# Altium project HDMI_Adapter_RevA.PrjPCB
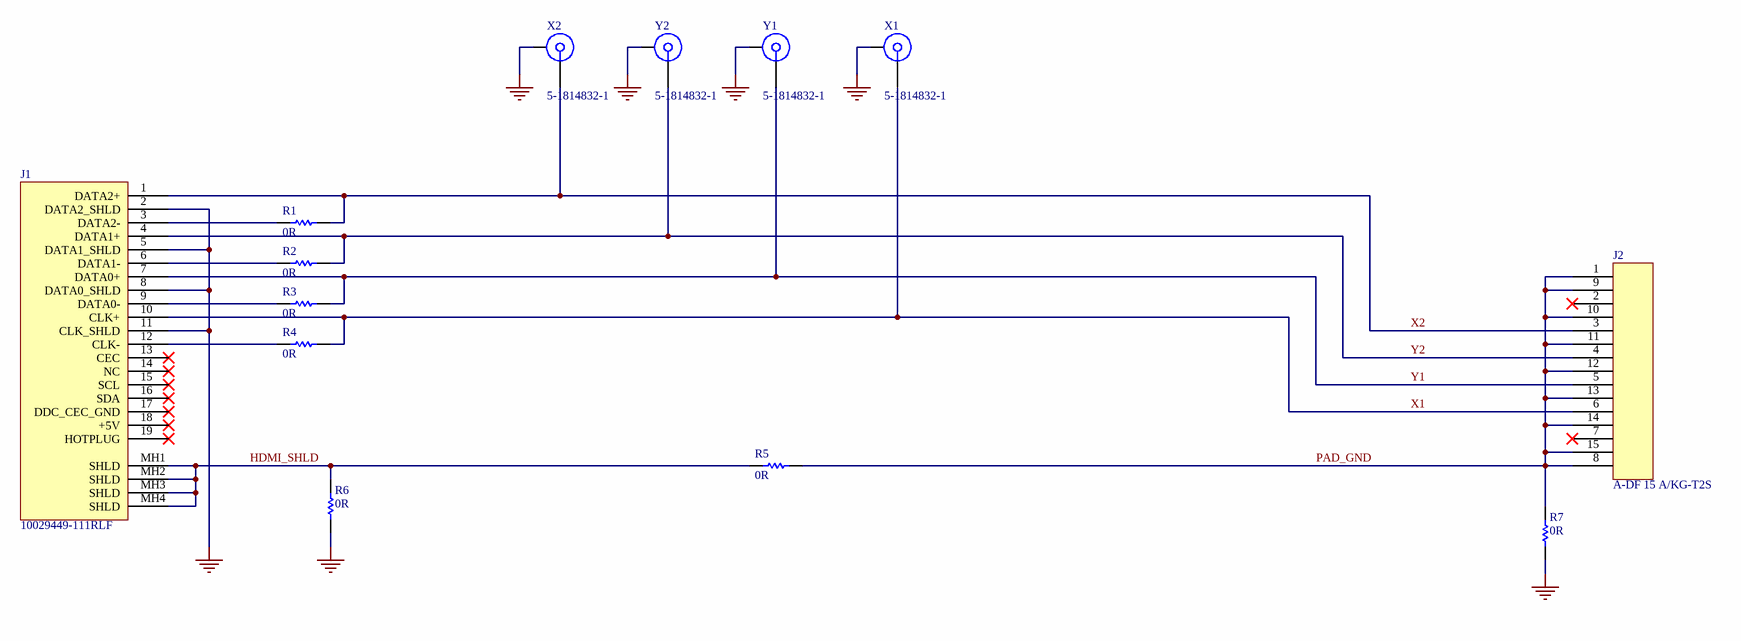
[diagram p0: HDMI_Adapter_RevA.SchDoc]
ProjectRevision: A
1 sheet, 13 parts. Net scope: global (net labels, ports and power ports of the same name join across sheets).
Board file: HDMI_Adapter_RevA.PcbDoc

## Sheet HDMI_Adapter_RevA.SchDoc
size Tabloid

### Parts
J1  10029449-111RLF  [10029449-111RLF]
J2  A-DF 15 A/KG-T2S  [A-DF 15 A/KG-T2S]
R1  value 0R  [RES-0603-M]  (hidden comment: RES 0R Jumper 1/10 W 0603)
R2  value 0R  [RES-0603-M]  (hidden comment: RES 0R Jumper 1/10 W 0603)
R3  value 0R  [RES-0603-M]  (hidden comment: RES 0R Jumper 1/10 W 0603)
R4  value 0R  [RES-0603-M]  (hidden comment: RES 0R Jumper 1/10 W 0603)
R5  value 0R  [RES-0603-M]  (hidden comment: RES 0R Jumper 1/10 W 0603)
R6  value 0R  [RES-0603-M]  (hidden comment: RES 0R Jumper 1/10 W 0603)
R7  value 0R  [RES-0603-M]  (hidden comment: RES 0R Jumper 1/10 W 0603)
X1  5-1814832-1  [5-1814832-1]
X2  5-1814832-1  [5-1814832-1]
Y1  5-1814832-1  [5-1814832-1]
Y2  5-1814832-1  [5-1814832-1]

### Nets
GND: J1.2(DATA2_SHLD) J1.5(DATA1_SHLD) J1.8(DATA0_SHLD) J1.11(CLK_SHLD) R6.2 R7.2 X1.MH X2.MH Y1.MH Y2.MH
HDMI_SHLD: J1.MH1(SHLD) J1.MH2(SHLD) J1.MH3(SHLD) J1.MH4(SHLD) R5.2 R6.1
PAD_GND: J2.1 J2.8 J2.9 J2.10 J2.11 J2.12 J2.13 J2.14 J2.15 R5.1 R7.1
X1: J1.10(CLK+) J2.6 R4.2 X1.1
X2: J1.1(DATA2+) J2.3 R1.1 X2.1
Y1: J1.7(DATA0+) J2.5 R3.1 Y1.1
Y2: J1.4(DATA1+) J2.4 R2.1 Y2.1
NetJ1_3: J1.3(DATA2-) R1.2
NetJ1_6: J1.6(DATA1-) R2.2
NetJ1_9: J1.9(DATA0-) R3.2
NetJ1_12: J1.12(CLK-) R4.1

Not connected (* = marked no-connect by the designer): J1 13(CEC)* 14(NC)* 15(SCL)* 16(SDA)* 17(DDC_CEC_GND)* 18(+5V)* 19(HOTPLUG)*; J2 2* 7*

### Notes on the sheet
- DATE
- REV
- BY
- SHEET
- 20
- /

### Library data of the parts
J2 = A-DF 15 A/KG-T2S: DA-15 Female, RIght Angle
R1-R7 = RC0603FR-070RL: Manufacturer: Yageo; Manufacturer Series: RC; Power: 1/10 W; Part Number: RC0603FR-070RL; Component Type: Standard; Tolerance: Jumper; Package: 0603; Temperature Range: -55°C ~ 155°C; Supplier 1: Digi-Key; Supplier Part Number 1: 311-0.0HRCT-ND